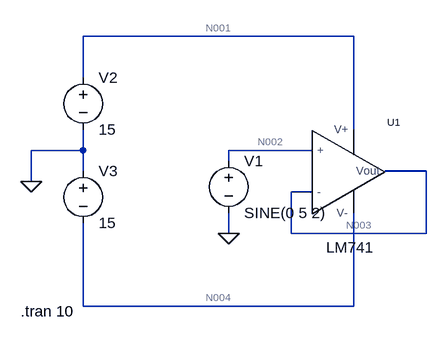
[diagram p0: schematic unity gain amp.asc]
unity gain amp.asc, the LTspice schematic file:
Version 4.1
SHEET 1 880 680
WIRE 224 -48 -192 -48
WIRE -192 16 -192 -48
WIRE 224 96 224 -48
WIRE -192 128 -192 96
WIRE -192 128 -272 128
WIRE 160 128 32 128
WIRE 32 144 32 128
WIRE -192 160 -192 128
WIRE 336 160 272 160
WIRE -272 176 -272 128
WIRE 160 192 128 192
WIRE 32 256 32 224
WIRE 128 256 128 192
WIRE 336 256 336 160
WIRE 336 256 128 256
WIRE -192 368 -192 240
WIRE 224 368 224 224
WIRE 224 368 -192 368
FLAG 32 256 0
FLAG -272 176 0
SYMBOL LM\ 741\\LM741 208 176 R0
SYMATTR InstName U1
SYMBOL voltage 32 128 R0
WINDOW 123 0 0 Left 0
WINDOW 39 0 0 Left 0
SYMATTR InstName V1
SYMATTR Value SINE(0 5 2)
SYMBOL voltage -192 0 R0
WINDOW 123 0 0 Left 0
WINDOW 39 0 0 Left 0
SYMATTR InstName V2
SYMATTR Value 15
SYMBOL voltage -192 144 R0
WINDOW 123 0 0 Left 0
WINDOW 39 0 0 Left 0
SYMATTR InstName V3
SYMATTR Value 15
TEXT -288 376 Left 2 !.tran 10

The netlist it stands for:
* unity gain amp.asc
X§U1 N002 N003 N001 N004 N003 LM741  ; pins + - V+ V- Vout
V1 N002 0 SINE(0 5 2)
V2 N001 0 15
V3 0 N004 15
.tran 10
.lib C:\Users\Subodha\Desktop\Desk\2nd Semester\Electronics\LT Spices\Unity gain amplifier\LM 741\lm741.lib
.backanno
.end

* Results of the author's LTspice run, read from the files saved beside the schematic
* Operating Point, zero values left out:
*   V(n003) = 1 mV
*   V(n004) = -15 V
*   V(n001) = 15 V
*   I(V1) = -57.86 nA
*   I(V2) = -1.701 mA
*   I(V3) = -1.701 mA
*   Ix(u1:1) = 57.86 nA
*   Ix(u1:2) = 101.9 nA
*   Ix(u1:99) = 1.701 mA
*   Ix(u1:50) = -1.701 mA
*   Ix(u1:28) = -101.9 nA
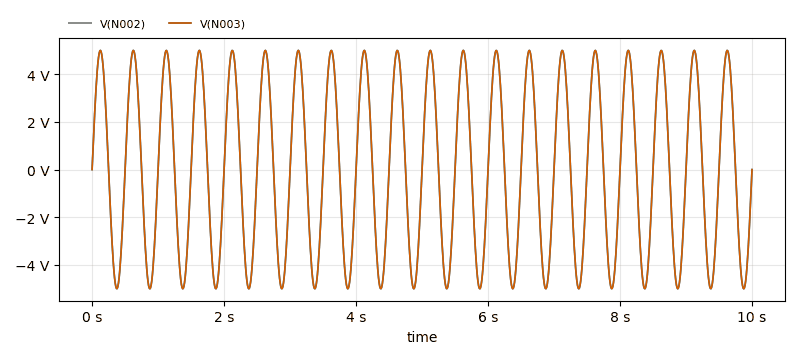
[diagram p1: Transient Analysis of unity gain amp.asc, plotted from the saved traces]
* Transient Analysis, 1 run:
*   V(N002): min -5 V, max 5 V, average 879.2 nV, rms 3.536 V, last 0 V
*   V(N003): min -4.999 V, max 5.001 V, average 1.001 mV, rms 3.536 V, last 991 µV